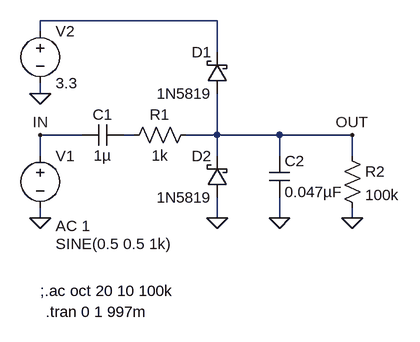
[diagram p0: schematic FV-1_Input_Circuit_+1V_0.047uF_tran.asc]
FV-1_Input_Circuit_+1V_0.047uF_tran.asc, the LTspice schematic file:
Version 4
SHEET 1 880 680
WIRE 368 -80 96 -80
WIRE 96 -64 96 -80
WIRE 368 -32 368 -80
WIRE 96 32 96 16
WIRE 160 96 96 96
WIRE 240 96 224 96
WIRE 368 96 368 32
WIRE 368 96 320 96
WIRE 464 96 368 96
WIRE 576 96 464 96
WIRE 96 128 96 96
WIRE 368 128 368 96
WIRE 464 128 464 96
WIRE 576 128 576 96
WIRE 96 224 96 208
WIRE 368 224 368 192
WIRE 464 224 464 192
WIRE 576 224 576 208
FLAG 96 224 0
FLAG 464 224 0
FLAG 576 224 0
FLAG 96 32 0
FLAG 96 96 IN
FLAG 576 96 OUT
FLAG 368 224 0
SYMBOL voltage 96 112 R0
WINDOW 3 24 152 Left 2
WINDOW 123 24 124 Left 2
WINDOW 39 0 0 Left 0
SYMATTR Value SINE(0.5 0.5 1k)
SYMATTR Value2 AC 1
SYMATTR InstName V1
SYMBOL cap 224 80 R90
WINDOW 0 0 32 VBottom 2
WINDOW 3 32 32 VTop 2
SYMATTR InstName C1
SYMATTR Value 1µ
SYMBOL res 336 80 R90
WINDOW 0 0 56 VBottom 2
WINDOW 3 32 56 VTop 2
SYMATTR InstName R1
SYMATTR Value 1k
SYMBOL cap 448 128 R0
SYMATTR InstName C2
SYMATTR Value 0.047µF
SYMBOL res 560 112 R0
SYMATTR InstName R2
SYMATTR Value 100k
SYMBOL schottky 384 32 R180
WINDOW 0 24 64 Left 2
WINDOW 3 24 0 Left 2
SYMATTR InstName D1
SYMATTR Value 1N5819
SYMBOL voltage 96 -80 R0
SYMATTR InstName V2
SYMATTR Value 3.3
SYMBOL schottky 384 192 R180
WINDOW 0 24 64 Left 2
WINDOW 3 24 0 Left 2
SYMATTR InstName D2
SYMATTR Value 1N5819
TEXT 96 336 Left 2 !;.ac oct 20 10 100k
TEXT 104 368 Left 2 !.tran 0 1 997m

The netlist it stands for:
* FV-1_Input_Circuit_+1V_0.047uF_tran.asc
V1 IN 0 SINE(0.5 0.5 1k) AC 1
C1 N002 IN 1µ
R1 OUT N002 1k
C2 OUT 0 0.047µF
R2 OUT 0 100k
D1 OUT N001 1N5819
V2 N001 0 3.3
D2 0 OUT 1N5819
.model D D
.lib standard.dio
;.ac oct 20 10 100k
.tran 0 1 997m
.backanno
.end